# Altium project uOpioid - rev.B0.PrjPCB
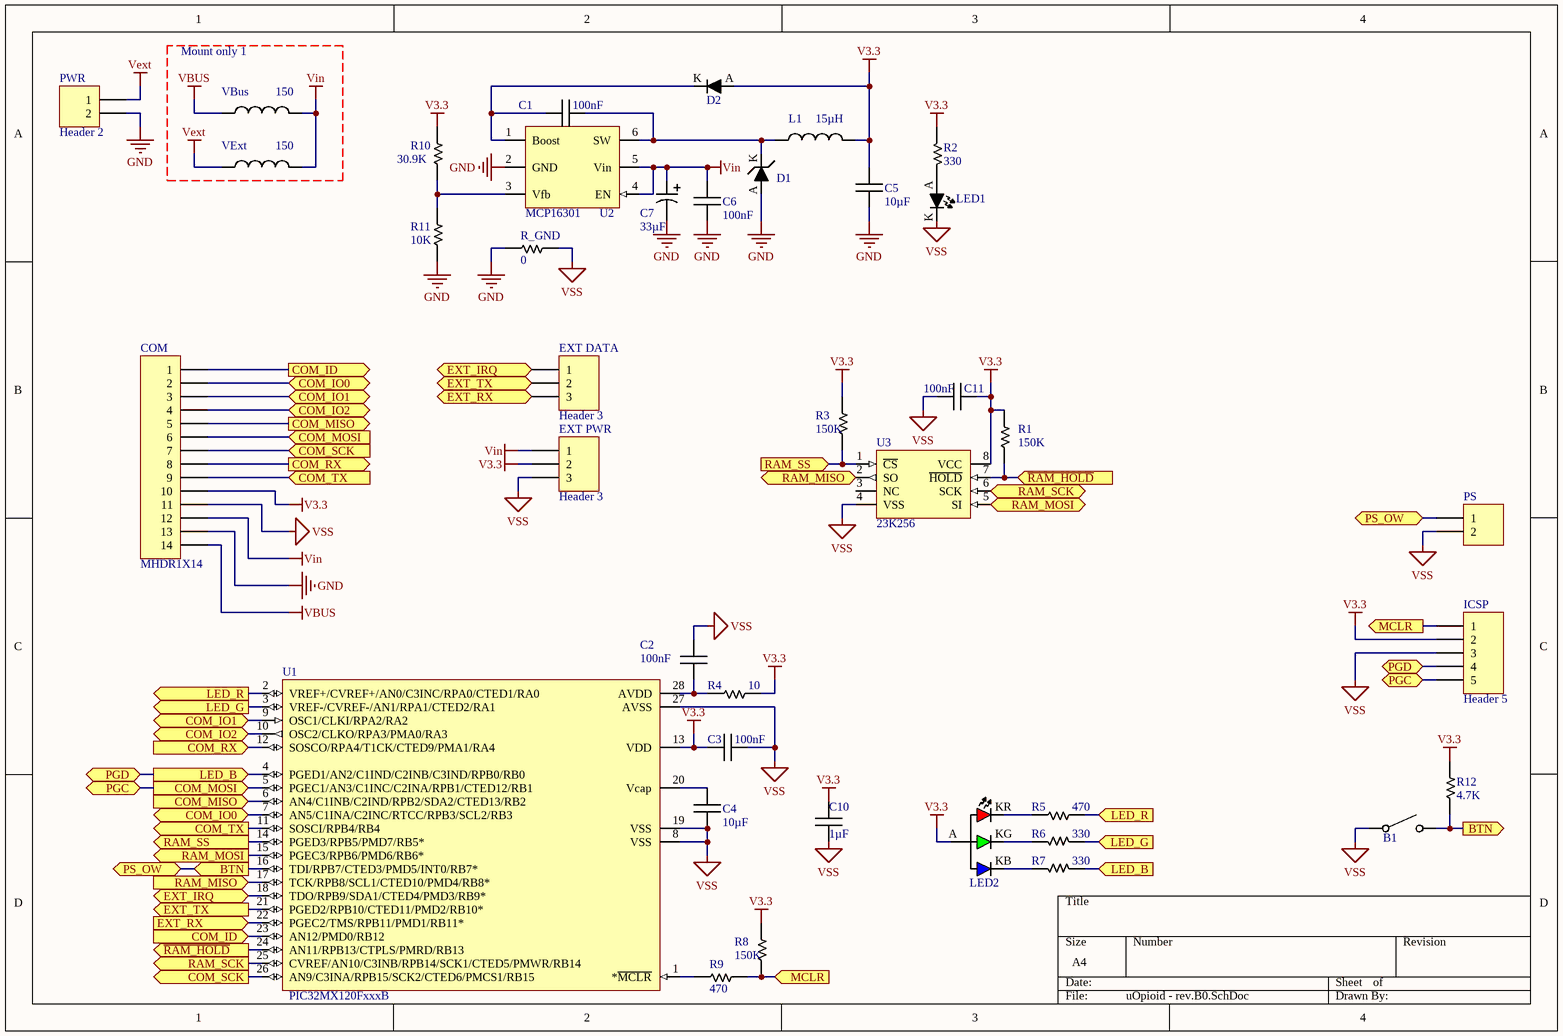
[diagram p0: uOpioid - rev.B0.SchDoc]
1 sheet, 39 parts. Net scope: flat (ports and power ports of the same name join across sheets).
Board file: uOpioid - rev.B0.PcbDoc

## Sheet uOpioid - rev.B0.SchDoc
size A4; DrawnBy: Laurence DV; Revision: A0; Time: Generic IO tiny

### Parts
B1  Tact Button NO  [Tact TH 4pin 6×6mm]  (value not drawn)
C1  100nF  [CAPC1608N]
C2  100nF  [CAPC1608N]
C3  100nF  [CAPC1608N]
C4  10µF  [CAPC2012N]
C5  10µF  [CAPC2012N]
C6  100nF  [CAPC1608N]
C7  33µF  [CAPPR2-5x11]
C10  1µF  [CAPC1608N]
C11  100nF  [CAPC1608N]
COM  MHDR1X14  [MHDR1X14]
D1  Schottky Diode  [DO-214AC]  (value not drawn)
D2  Diode  [SOT323]  (value not drawn)
EXT_DATA  Header 3  [HDR1X3]
EXT_PWR  Header 3  [HDR1X3]
ICSP  Header 5  [HDR1X5]
L1  15µH  [INDUCTOR 6×6mm Taiyo Yuden]
LED1  (no value)  [LED 1608m]
LED2  LED RGB common A  [LED 3528m]  (value not drawn)
PS  MHDR1X2  [MHDR1X2]  (value not drawn)
PWR  Header 2  [HDR1X2]
R1  150K  [RESC1608N]
R2  330  [RESC1608N]
R3  150K  [RESC1608N]
R4  10  [RESC1608N]
R5  470  [RESC1608N]
R6  330  [RESC1608N]
R7  330  [RESC1608N]
R8  150K  [RESC1608N]
R9  470  [RESC1608N]
R10  30.9K  [RESC1608N]
R11  10K  [RESC1608N]
R12  4.7K  [RESC1608N]
R_GND  0  [RESC1608N]
U1  PIC32MX120FxxxB  [SSOP28_N]
U2  MCP16301  [SOT23-6_N]
U3  23K256  [TSSOP8N_N]
VBus  150  [INDC1608N]
VExt  150  [INDC1608N]

### Ports
BTN (in), BTN (out), COM_ID (in), COM_ID (out), COM_IO0 (bidir), COM_IO1 (bidir), COM_IO2 (bidir), COM_MISO (in), COM_MISO (out), COM_MOSI (in), COM_MOSI (out), COM_RX (in), COM_RX (out), COM_SCK (in), COM_SCK (out), COM_TX (in), COM_TX (out), EXT_IRQ (bidir), EXT_RX (in), EXT_RX (out), EXT_TX (in), EXT_TX (out), LED_B (in), LED_B (out), LED_G (in), LED_G (out), LED_R (in), LED_R (out), MCLR (in), MCLR (out), PGC (bidir), PGD (bidir), PS_OW (bidir), RAM_MISO (in), RAM_MISO (out), RAM_MOSI (in), RAM_MOSI (out), RAM_SCK (in), RAM_SCK (out), RAM_SS (in), RAM_SS (out), ~{RAM_HOLD} (in), ~{RAM_HOLD} (out)

### Nets
GND: C5.1 C6.2 C7.2 COM.13 D1.A(Anode) PWR.2 R11.1 R_GND.1 U2.2(GND)
V3.3: C3.2 C5.2 C10.2 C11.2 COM.10 D2.A EXT_PWR.2 ICSP.2 L1.2 LED2.A R1.2 R2.1 R3.2 R4.2 R8.2 R10.2 R12.2 U1.13(VDD) U3.8(VCC)
VBUS: COM.14 VBus.1
Vext: PWR.1 VExt.1
Vin: C6.1 C7.1 COM.12 EXT_PWR.1 U2.4(EN) U2.5(Vin) VBus.2 VExt.2
VSS: B1.1 C2.2 C3.1 C4.1 C10.1 C11.1 COM.11 EXT_PWR.3 ICSP.3 LED1.K PS.2 R_GND.2 U1.8(VSS) U1.19(VSS) U1.27(AVSS) U3.4(VSS)
NetB1_2: B1.2 PS.1 R12.1 U1.16(TDI/RPB7/CTED3/PMD5/INT0/RB7*) ; port BTN, port PS_OW
NetC1_1: C1.1 D1.K(Kathode) L1.1 U2.6(SW)
NetC1_2: C1.2 D2.K U2.1(Boost)
NetC2_1: C2.1 R4.1 U1.28(AVDD)
NetC4_2: C4.2 U1.20(Vcap)
NetCOM_1: COM.1 U1.23(AN12/PMD0/RB12) ; port COM_ID
NetCOM_2: COM.2 U1.7(AN5/C1INA/C2INC/RTCC/RPB3/SCL2/RB3) ; port COM_IO0
NetCOM_3: COM.3 U1.9(OSC1/CLKI/RPA2/RA2) ; port COM_IO1
NetCOM_4: COM.4 U1.10(OSC2/CLKO/RPA3/PMA0/RA3) ; port COM_IO2
NetCOM_5: COM.5 U1.6(AN4/C1INB/C2IND/RPB2/SDA2/CTED13/RB2) ; port COM_MISO
NetCOM_6: COM.6 ICSP.5 U1.5(PGEC1/AN3/C1INC/C2INA/RPB1/CTED12/RB1) ; port COM_MOSI, port PGC
NetCOM_7: COM.7 U1.26(AN9/C3INA/RPB15/SCK2/CTED6/PMCS1/RB15) ; port COM_SCK
NetCOM_8: COM.8 U1.12(SOSCO/RPA4/T1CK/CTED9/PMA1/RA4) ; port COM_RX
NetCOM_9: COM.9 U1.11(SOSCI/RPB4/RB4) ; port COM_TX
NetEXT_DATA_1: EXT_DATA.1 U1.18(TDO/RPB9/SDA1/CTED4/PMD3/RB9*) ; port EXT_IRQ
NetEXT_DATA_2: EXT_DATA.2 U1.21(PGED2/RPB10/CTED11/PMD2/RB10*) ; port EXT_TX
NetEXT_DATA_3: EXT_DATA.3 U1.22(PGEC2/TMS/RPB11/PMD1/RB11*) ; port EXT_RX
NetICSP_1: ICSP.1 R8.1 R9.2 ; port MCLR
NetICSP_4: ICSP.4 R7.2 U1.4(PGED1/AN2/C1IND/C2INB/C3IND/RPB0/RB0) ; port LED_B, port PGD
NetLED1_A: LED1.A R2.2
NetLED2_KB: LED2.KB R7.1
NetLED2_KG: LED2.KG R6.1
NetLED2_KR: LED2.KR R5.1
NetR1_1: R1.1 U1.24(AN11/RPB13/CTPLS/PMRD/RB13) U3.7(~{HOLD}) ; port ~{RAM_HOLD}
NetR3_1: R3.1 U1.14(PGED3/RPB5/PMD7/RB5*) U3.1(~{CS}) ; port RAM_SS
NetR5_2: R5.2 U1.2(VREF+/CVREF+/AN0/C3INC/RPA0/CTED1/RA0) ; port LED_R
NetR6_2: R6.2 U1.3(VREF-/CVREF-/AN1/RPA1/CTED2/RA1) ; port LED_G
NetR9_1: R9.1 U1.1(*~{MCLR})
NetR10_1: R10.1 R11.2 U2.3(Vfb)
NetU1_15: U1.15(PGEC3/RPB6/PMD6/RB6*) U3.5(SI) ; port RAM_MOSI
NetU1_17: U1.17(TCK/RPB8/SCL1/CTED10/PMD4/RB8*) U3.2(SO) ; port RAM_MISO
NetU1_25: U1.25(CVREF/AN10/C3INB/RPB14/SCK1/CTED5/PMWR/RB14) U3.6(SCK) ; port RAM_SCK

Not connected (* = marked no-connect by the designer): U3 3(NC)

### Notes on the sheet
- Mount only 1

### Library data of the parts
B1 = Tact Button NO: pin to pad: 1>1+2 2>3+4
C1 C6 = Capacitor: Voltage Rating: 50V; Value: 100nF
C2-C5 C10 C11 = Capacitor
  C2 C3 C11: Value: 100nF
  C4 C5: Value: 10µF
  C10: Value: 1µF
C7 = Capacitor Polarised: Voltage Rating: 50V; Value: 33µF
COM = MHDR1X14: Header, 14-Pin; LatestRevisionDate: 17-Jul-2002; LatestRevisionNote: Re-released for DXP Platform.; Publisher: Altium Limited
D1 = Schottky Diode: Model: SS14
D2 = Diode: pin to pad: A>1 K>3; Model: M1MA141KT1G
EXT_DATA EXT_PWR = Header 3: Header, 3-Pin; LatestRevisionDate: 17-Jul-2002; LatestRevisionNote: Re-released for DXP Platform.; Publisher: Altium Limited
ICSP = Header 5: Header, 5-Pin; LatestRevisionDate: 17-Jul-2002; LatestRevisionNote: Re-released for DXP Platform.; Publisher: Altium Limited
L1 VBus VExt = Inductor
  L1: Value: 15µH
  VBus VExt: Value: 150
LED1 = LED: pin to pad: A>1 K>2
LED2 = LED RGB common A: pin to pad: A>2 KB>3 KG>4 KR>1
PS = MHDR1X2: Header, 2-Pin; LatestRevisionDate: 17-Jul-2002; LatestRevisionNote: Re-released for DXP Platform.; Publisher: Altium Limited
PWR = Header 2: Header, 2-Pin; LatestRevisionDate: 17-Jul-2002; LatestRevisionNote: Re-released for DXP Platform.; Publisher: Altium Limited
R1-R12 R_GND = Resistor
  R1 R3 R8: Value: 150K
  R2 R6 R7: Value: 330
  R4: Value: 10
  R5 R9: Value: 470
  R10: Value: 30.9K
  R11: Value: 10K
  R12: Value: 4.7K
  R_GND: Value: 0
U2 = MCP16301: Vout: *